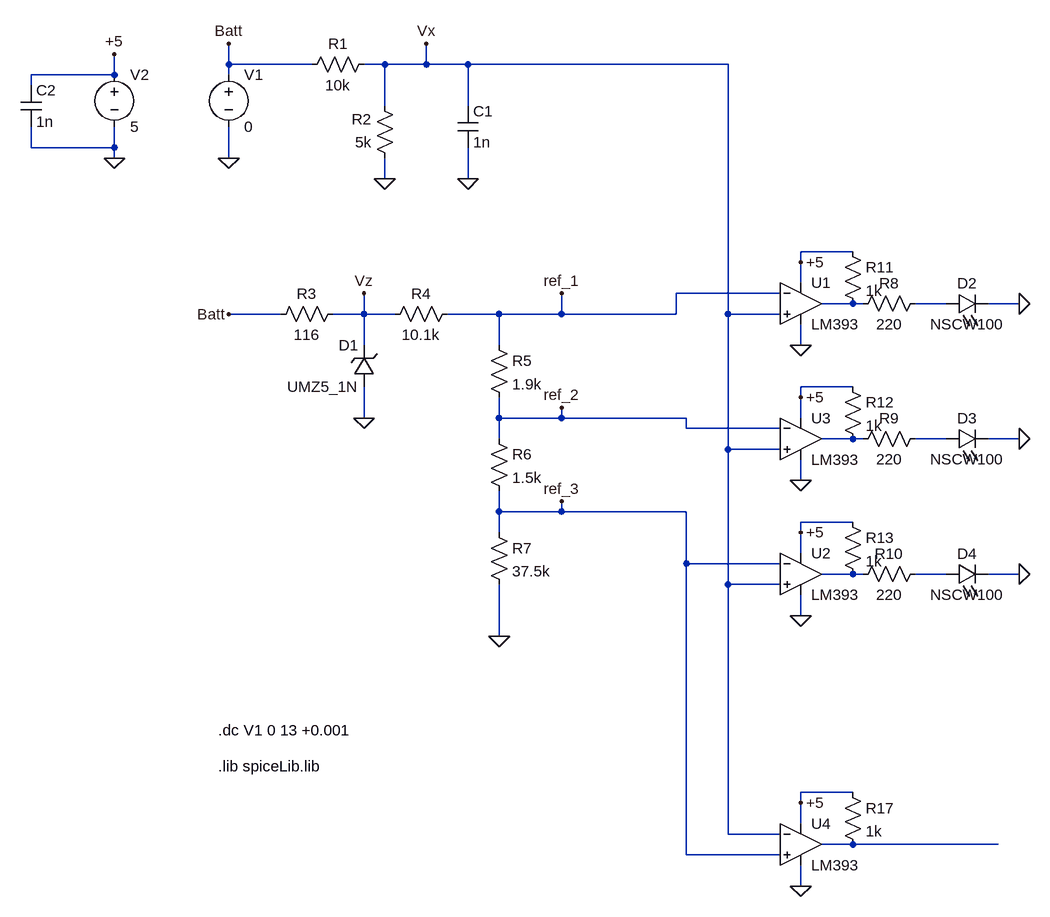
[diagram p0: schematic LevelBatt.asc]
LevelBatt.asc, the LTspice schematic file:
Version 4
SHEET 1 1664 1448
WIRE 32 128 32 96
WIRE 160 128 32 128
WIRE 272 128 240 128
WIRE 336 128 336 96
WIRE 336 128 272 128
WIRE 400 128 336 128
WIRE 800 128 400 128
WIRE -144 144 -144 112
WIRE -144 144 -272 144
WIRE 32 144 32 128
WIRE -272 160 -272 144
WIRE 272 192 272 128
WIRE 400 192 400 128
WIRE -272 256 -272 224
WIRE -144 256 -144 224
WIRE -144 256 -272 256
WIRE -144 272 -144 256
WIRE 32 272 32 224
WIRE 272 304 272 272
WIRE 400 304 400 256
WIRE 992 416 912 416
WIRE 912 432 912 416
WIRE 912 464 912 432
WIRE 880 480 720 480
WIRE 992 496 944 496
WIRE 1008 496 992 496
WIRE 1136 496 1088 496
WIRE 1248 496 1200 496
WIRE 112 512 32 512
WIRE 240 512 240 480
WIRE 240 512 192 512
WIRE 288 512 240 512
WIRE 448 512 368 512
WIRE 544 512 544 480
WIRE 544 512 448 512
WIRE 720 512 720 480
WIRE 720 512 544 512
WIRE 800 512 800 128
WIRE 880 512 800 512
WIRE 240 560 240 512
WIRE 448 560 448 512
WIRE 912 560 912 528
WIRE 992 624 912 624
WIRE 912 640 912 624
WIRE 240 672 240 624
WIRE 448 672 448 640
WIRE 544 672 544 656
WIRE 544 672 448 672
WIRE 736 672 544 672
WIRE 912 672 912 640
WIRE 736 688 736 672
WIRE 880 688 736 688
WIRE 448 704 448 672
WIRE 992 704 944 704
WIRE 1008 704 992 704
WIRE 1136 704 1088 704
WIRE 1248 704 1200 704
WIRE 800 720 800 512
WIRE 880 720 800 720
WIRE 912 768 912 736
WIRE 448 816 448 784
WIRE 544 816 544 800
WIRE 544 816 448 816
WIRE 736 816 544 816
WIRE 992 832 912 832
WIRE 448 848 448 816
WIRE 912 848 912 832
WIRE 912 880 912 848
WIRE 736 896 736 816
WIRE 880 896 736 896
WIRE 992 912 944 912
WIRE 1008 912 992 912
WIRE 1136 912 1088 912
WIRE 1248 912 1200 912
WIRE 800 928 800 720
WIRE 880 928 800 928
WIRE 912 976 912 944
WIRE 448 1008 448 928
WIRE 992 1248 912 1248
WIRE 912 1264 912 1248
WIRE 912 1296 912 1264
WIRE 800 1312 800 928
WIRE 880 1312 800 1312
WIRE 992 1328 944 1328
WIRE 1216 1328 992 1328
WIRE 736 1344 736 896
WIRE 880 1344 736 1344
WIRE 912 1392 912 1360
FLAG 32 96 Batt
FLAG 32 272 0
FLAG 272 304 0
FLAG 336 96 Vx
FLAG 32 512 Batt
FLAG 240 672 0
FLAG 240 480 Vz
FLAG 448 1008 0
FLAG 544 480 ref_1
FLAG 544 656 ref_2
FLAG 544 800 ref_3
FLAG 912 432 +5
FLAG 912 640 +5
FLAG 912 848 +5
FLAG 1248 912 0
FLAG 1248 704 0
FLAG 1248 496 0
FLAG 912 560 0
FLAG 912 768 0
FLAG 912 976 0
FLAG -144 272 0
FLAG -144 112 +5
FLAG 912 1264 +5
FLAG 912 1392 0
FLAG 400 304 0
SYMBOL voltage 32 128 R0
WINDOW 123 0 0 Left 0
WINDOW 39 0 0 Left 0
SYMATTR InstName V1
SYMATTR Value 0
SYMBOL res 256 112 R90
WINDOW 0 0 56 VBottom 2
WINDOW 3 32 56 VTop 2
SYMATTR InstName R1
SYMATTR Value 10k
SYMBOL res 288 288 R180
WINDOW 0 36 76 Left 2
WINDOW 3 36 40 Left 2
SYMATTR InstName R2
SYMATTR Value 5k
SYMBOL res 208 496 R90
WINDOW 0 0 56 VBottom 2
WINDOW 3 32 56 VTop 2
SYMATTR InstName R3
SYMATTR Value 116
SYMBOL zener 256 624 R180
WINDOW 0 24 64 Left 2
WINDOW 3 24 0 Left 2
SYMATTR InstName D1
SYMATTR Value UMZ5_1N
SYMATTR Description Diode
SYMATTR Type diode
SYMBOL res 384 496 R90
WINDOW 0 0 56 VBottom 2
WINDOW 3 32 56 VTop 2
SYMATTR InstName R4
SYMATTR Value 10.1k
SYMBOL res 432 544 R0
SYMATTR InstName R5
SYMATTR Value 1.9k
SYMBOL res 432 688 R0
SYMATTR InstName R6
SYMATTR Value 1.5k
SYMBOL res 432 832 R0
SYMATTR InstName R7
SYMATTR Value 37.5k
SYMBOL OpAmps\\opamp2 912 432 R0
SYMATTR InstName U1
SYMATTR Value LM393
SYMBOL OpAmps\\opamp2 912 848 R0
SYMATTR InstName U2
SYMATTR Value LM393
SYMBOL OpAmps\\opamp2 912 640 R0
SYMATTR InstName U3
SYMATTR Value LM393
SYMBOL res 1104 480 R90
WINDOW 0 0 56 VBottom 2
WINDOW 3 32 56 VTop 2
SYMATTR InstName R8
SYMATTR Value 220
SYMBOL res 1104 688 R90
WINDOW 0 0 56 VBottom 2
WINDOW 3 32 56 VTop 2
SYMATTR InstName R9
SYMATTR Value 220
SYMBOL res 1104 896 R90
WINDOW 0 0 56 VBottom 2
WINDOW 3 32 56 VTop 2
SYMATTR InstName R10
SYMATTR Value 220
SYMBOL LED 1136 512 R270
WINDOW 0 32 32 VTop 2
WINDOW 3 0 32 VBottom 2
SYMATTR InstName D2
SYMATTR Value NSCW100
SYMATTR Description Diode
SYMATTR Type diode
SYMBOL LED 1136 720 R270
WINDOW 0 32 32 VTop 2
WINDOW 3 0 32 VBottom 2
SYMATTR InstName D3
SYMATTR Value NSCW100
SYMATTR Description Diode
SYMATTR Type diode
SYMBOL LED 1136 928 R270
WINDOW 0 32 32 VTop 2
WINDOW 3 0 32 VBottom 2
SYMATTR InstName D4
SYMATTR Value NSCW100
SYMATTR Description Diode
SYMATTR Type diode
SYMBOL res 976 400 R0
SYMATTR InstName R11
SYMATTR Value 1k
SYMBOL res 976 608 R0
SYMATTR InstName R12
SYMATTR Value 1k
SYMBOL res 976 816 R0
SYMATTR InstName R13
SYMATTR Value 1k
SYMBOL voltage -144 128 R0
WINDOW 123 0 0 Left 0
WINDOW 39 0 0 Left 0
SYMATTR InstName V2
SYMATTR Value 5
SYMBOL OpAmps\\opamp2 912 1264 R0
SYMATTR InstName U4
SYMATTR Value LM393
SYMBOL res 976 1232 R0
SYMATTR InstName R17
SYMATTR Value 1k
SYMBOL cap 384 192 R0
SYMATTR InstName C1
SYMATTR Value 1n
SYMBOL cap -288 160 R0
SYMATTR InstName C2
SYMATTR Value 1n
TEXT 16 1208 Left 2 !.lib spiceLib.lib
TEXT 16 1152 Left 2 !.dc V1 0 13 +0.001

The netlist it stands for:
* LevelBatt.asc
V1 Batt 0 0
R1 Vx Batt 10k
R2 0 Vx 5k
R3 Vz Batt 116
D1 0 Vz UMZ5_1N
R4 ref_1 Vz 10.1k
R5 ref_1 ref_2 1.9k
R6 ref_2 ref_3 1.5k
R7 ref_3 0 37.5k
XU1 Vx ref_1 +5 0 N001 LM393  ; pins In+ In- V+ V- OUT
XU2 Vx ref_3 +5 0 N005 LM393  ; pins In+ In- V+ V- OUT
XU3 Vx ref_2 +5 0 N003 LM393  ; pins In+ In- V+ V- OUT
R8 N002 N001 220
R9 N004 N003 220
R10 N006 N005 220
D2 N002 0 NSCW100
D3 N004 0 NSCW100
D4 N006 0 NSCW100
R11 +5 N001 1k
R12 +5 N003 1k
R13 +5 N005 1k
V2 +5 0 5
XU4 ref_3 Vx +5 0 N007 LM393  ; pins In+ In- V+ V- OUT
R17 +5 N007 1k
C1 Vx 0 1n
C2 +5 0 1n
.model D D
.lib standard.dio
.lib spiceLib.lib
.dc V1 0 13 +0.001
.backanno
.end